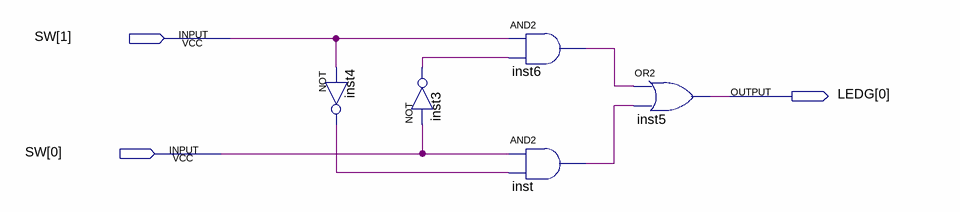
[diagram p0: schematic sheet]
// Quartus schematic Light.bdf as structural Verilog: 5 symbols, 3 pins
module Light (
  input  [1:0] SW,
  output [0:0] LEDG
);

  wire inst3_out, inst4_out, inst6_out, inst_out;

  not inst4 (inst4_out, SW[1]);
  not inst3 (inst3_out, SW[0]);
  and inst6 (inst6_out, SW[1], inst3_out);
  and inst (inst_out, SW[0], inst4_out);
  or inst5 (LEDG[0], inst6_out, inst_out);
endmodule
